# Altium schematic sheet 13_Temp3.SchDoc: Misc
size A3; Organization: Lime Microsystems; Address1: Surrey Tech Centre; Address2: Guildford GU2 7YG; Address3: Surrey; Address4: United Kingdom; Revision: v1.1; SheetNumber: 10; SheetTotal: 10
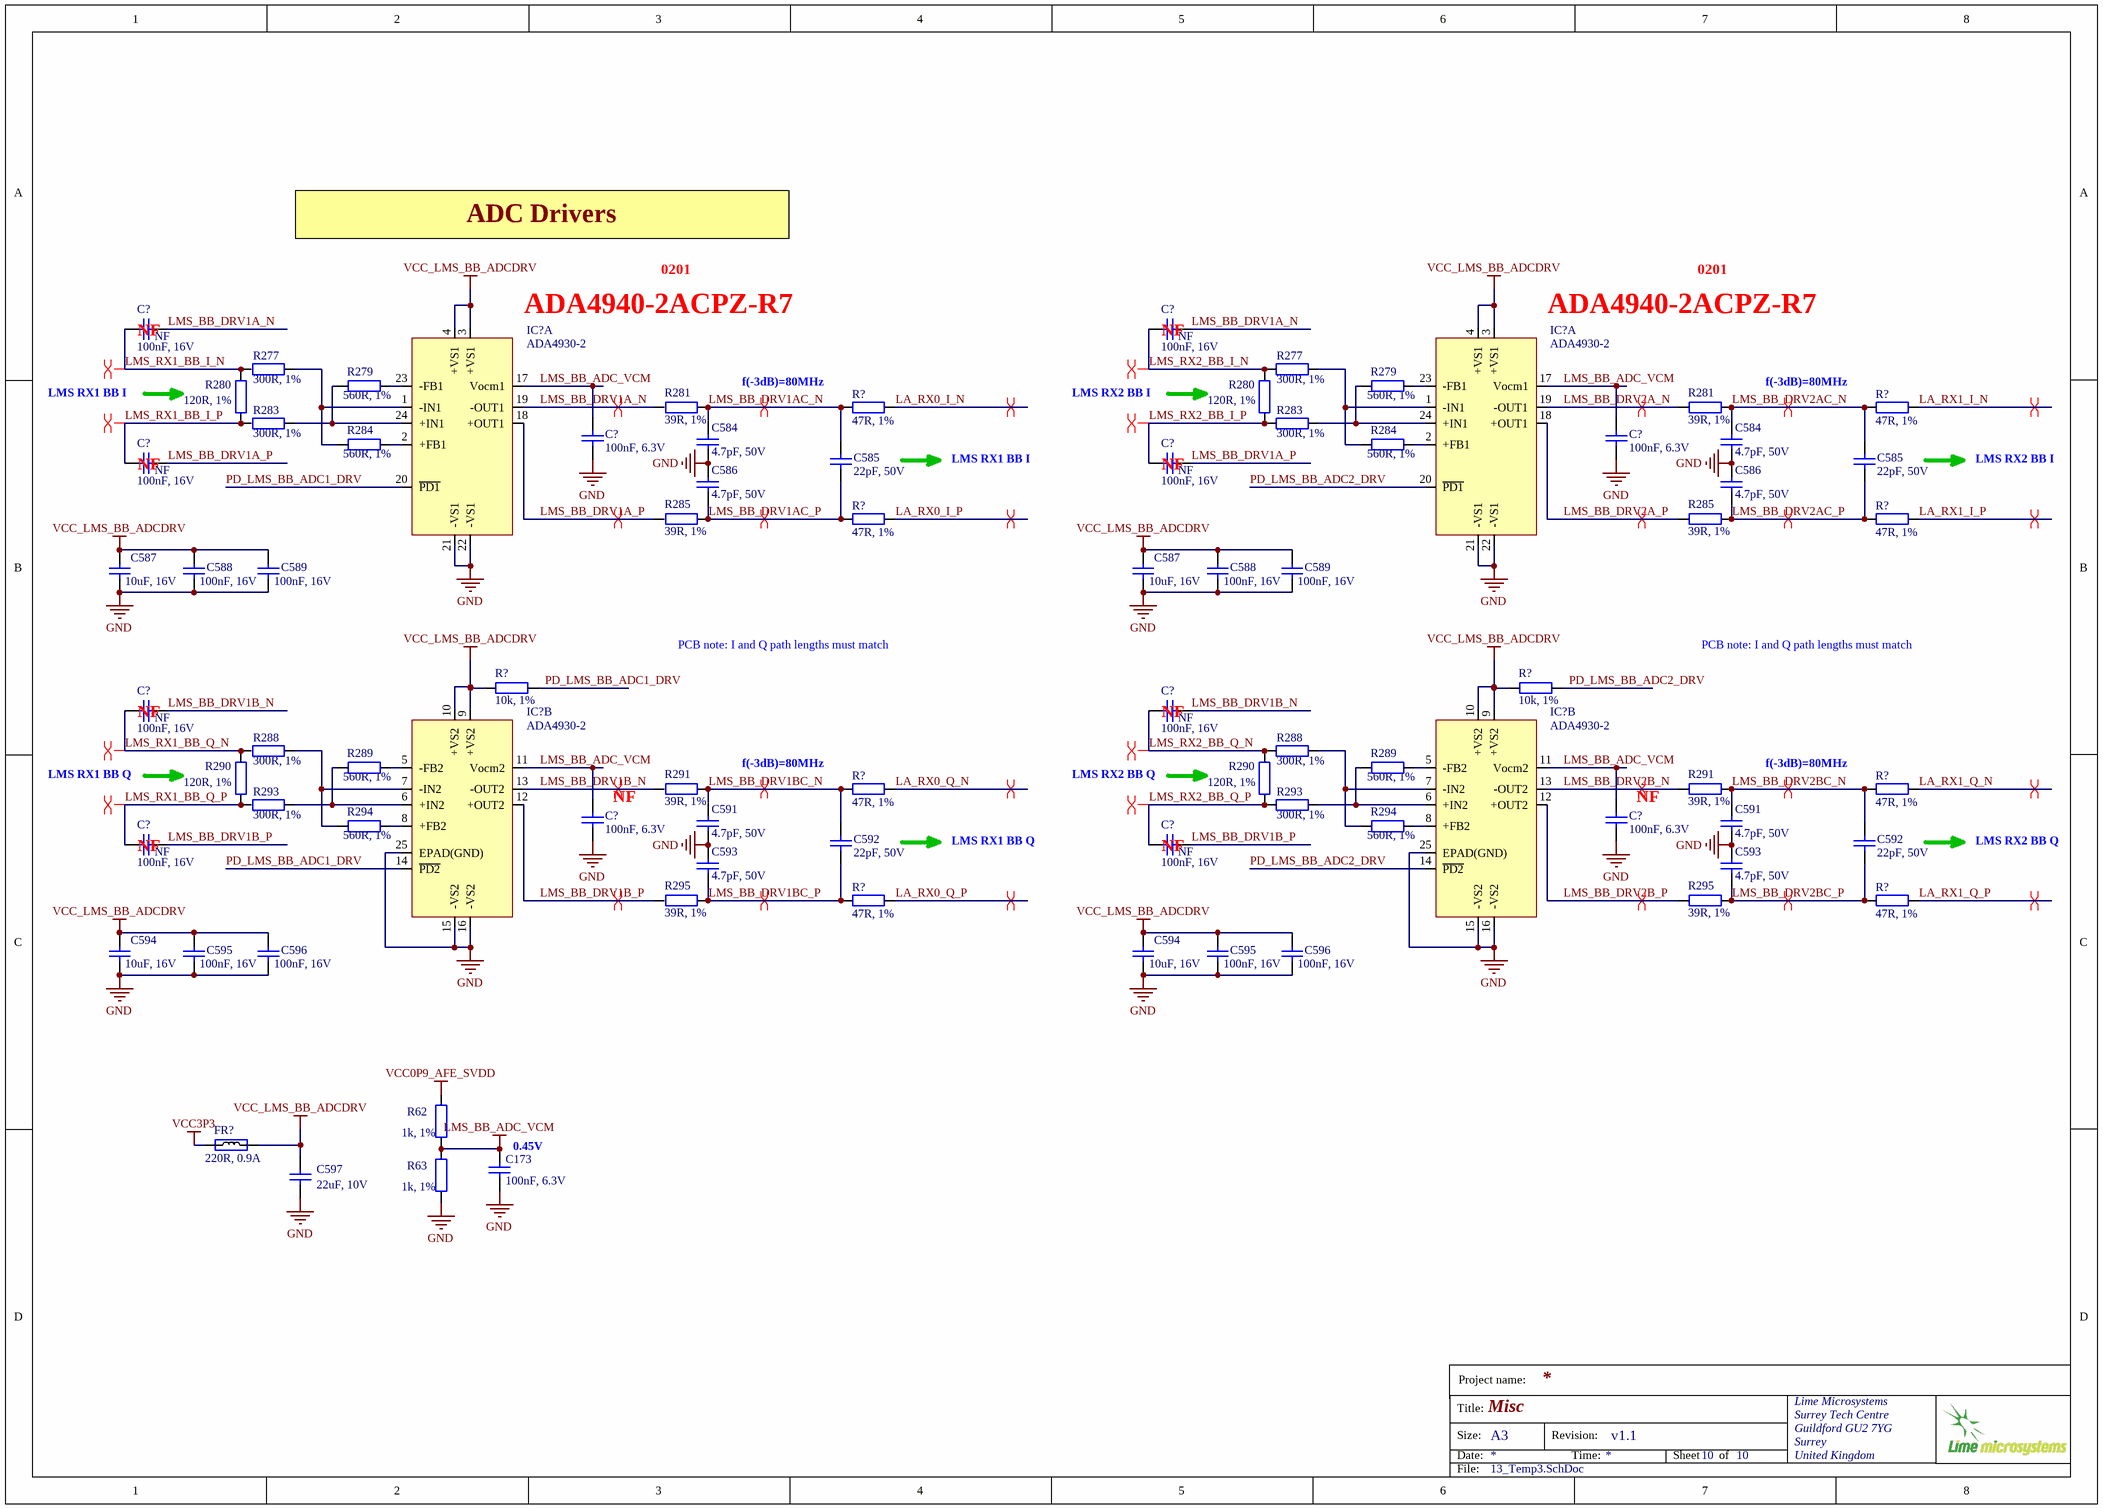
[diagram p0: 13_Temp3.SchDoc]

## Parts
(Parts that share a designator on the sheet are numbered #1, #2 ... from top to bottom, then left to right.)
C173  100nF, 6.3V  [CAP0201]
C584#1  4.7pF, 50V  [CAP0402]
C584#2  4.7pF, 50V  [CAP0402]
C585#1  22pF, 50V  [CAP0402]
C585#2  22pF, 50V  [CAP0402]
C586#1  4.7pF, 50V  [CAP0402]
C586#2  4.7pF, 50V  [CAP0402]
C587#1  10uF, 16V  [CAP0603]
C587#2  10uF, 16V  [CAP0603]
C588#1  100nF, 16V  [CAP0402]
C588#2  100nF, 16V  [CAP0402]
C589#1  100nF, 16V  [CAP0402]
C589#2  100nF, 16V  [CAP0402]
C591#1  4.7pF, 50V  [CAP0402]
C591#2  4.7pF, 50V  [CAP0402]
C592#1  22pF, 50V  [CAP0402]
C592#2  22pF, 50V  [CAP0402]
C593#1  4.7pF, 50V  [CAP0402]
C593#2  4.7pF, 50V  [CAP0402]
C594#1  10uF, 16V  [CAP0603]
C594#2  10uF, 16V  [CAP0603]
C595#1  100nF, 16V  [CAP0402]
C595#2  100nF, 16V  [CAP0402]
C596#1  100nF, 16V  [CAP0402]
C596#2  100nF, 16V  [CAP0402]
C597  22uF, 10V  [CAP0603]
C?#1  100nF, 16V  Assembly Info: NF  [CAP0402]
C?#2  100nF, 16V  Assembly Info: NF  [CAP0402]
C?#3  100nF, 6.3V  [CAP0201]
C?#4  100nF, 6.3V  [CAP0201]
C?#5  100nF, 16V  Assembly Info: NF  [CAP0402]
C?#6  100nF, 16V  Assembly Info: NF  [CAP0402]
C?#7  100nF, 16V  Assembly Info: NF  [CAP0402]
C?#8  100nF, 16V  Assembly Info: NF  [CAP0402]
C?#9  100nF, 6.3V  [CAP0201]
C?#10  100nF, 6.3V  [CAP0201]
C?#11  100nF, 16V  Assembly Info: NF  [CAP0402]
C?#12  100nF, 16V  Assembly Info: NF  [CAP0402]
FR?  220R, 0.9A  [RES0402]
IC?#1  ADA4930-2  [ADA4930-2_LFCSP-24]  (part A of 2)
IC?#2  ADA4930-2  [ADA4930-2_LFCSP-24]  (part A of 2)
IC?#3  ADA4930-2  [ADA4930-2_LFCSP-24]  (part B of 2)
IC?#4  ADA4930-2  [ADA4930-2_LFCSP-24]  (part B of 2)
R62  1k, 1%  [RES0201]
R63  1k, 1%  [RES0201]
R277#1  300R, 1%  [RES0402]
R277#2  300R, 1%  [RES0402]
R279#1  560R, 1%  [RES0402]
R279#2  560R, 1%  [RES0402]
R280#1  120R, 1%  [RES0402]
R280#2  120R, 1%  [RES0402]
R281#1  39R, 1%  [RES0402]
R281#2  39R, 1%  [RES0402]
R283#1  300R, 1%  [RES0402]
R283#2  300R, 1%  [RES0402]
R284#1  560R, 1%  [RES0402]
R284#2  560R, 1%  [RES0402]
R285#1  39R, 1%  [RES0402]
R285#2  39R, 1%  [RES0402]
R288#1  300R, 1%  [RES0402]
R288#2  300R, 1%  [RES0402]
R289#1  560R, 1%  [RES0402]
R289#2  560R, 1%  [RES0402]
R290#1  120R, 1%  [RES0402]
R290#2  120R, 1%  [RES0402]
R291#1  39R, 1%  [RES0402]
R291#2  39R, 1%  [RES0402]
R293#1  300R, 1%  [RES0402]
R293#2  300R, 1%  [RES0402]
R294#1  560R, 1%  [RES0402]
R294#2  560R, 1%  [RES0402]
R295#1  39R, 1%  [RES0402]
R295#2  39R, 1%  [RES0402]
R?#1  47R, 1%  [RES0201]
R?#2  47R, 1%  [RES0201]
R?#3  47R, 1%  [RES0201]
R?#4  47R, 1%  [RES0201]
R?#5  10k, 1%  [RES0201]
R?#6  10k, 1%  [RES0201]
R?#7  47R, 1%  [RES0201]
R?#8  47R, 1%  [RES0201]
R?#9  47R, 1%  [RES0201]
R?#10  47R, 1%  [RES0201]

## Nets
GND: C173.2 C584#1.2 C584#2.2 C586#1.1 C586#2.1 C587#1.1 C587#2.1 C588#1.2 C588#2.2 C589#1.2 C589#2.2 C591#1.2 C591#2.2 C593#1.1 C593#2.1 C594#1.1 C594#2.1 C595#1.2 C595#2.2 C596#1.2 C596#2.2 C597.1 C?#3.1 C?#4.1 C?#9.1 C?#10.1 IC?#1.21(-VS1) IC?#1.22(-VS1) IC?#2.21(-VS1) IC?#2.22(-VS1) IC?#3.15(-VS2) IC?#3.16(-VS2) IC?#3.25(EPAD(GND)) IC?#4.15(-VS2) IC?#4.16(-VS2) IC?#4.25(EPAD(GND)) R63.2
LMS_BB_ADC_VCM: C173.1 C?#3.2 C?#4.2 C?#9.2 C?#10.2 IC?#1.17(Vocm1) IC?#2.17(Vocm1) IC?#3.11(Vocm2) IC?#4.11(Vocm2) R62.2 R63.1
VCC0P9_AFE_SVDD: R62.1
VCC3P3: FR?.1
VCC_LMS_BB_ADCDRV: C587#1.2 C587#2.2 C588#1.1 C588#2.1 C589#1.1 C589#2.1 C594#1.2 C594#2.2 C595#1.1 C595#2.1 C596#1.1 C596#2.1 C597.2 FR?.2 IC?#1.3(+VS1) IC?#1.4(+VS1) IC?#2.3(+VS1) IC?#2.4(+VS1) IC?#3.9(+VS2) IC?#3.10(+VS2) IC?#4.9(+VS2) IC?#4.10(+VS2) R?#5.1 R?#6.1
LA_RX0_I_N: R?#1.1
LA_RX0_I_P: R?#3.1
LA_RX0_Q_N: R?#7.1
LA_RX0_Q_P: R?#9.1
LA_RX1_I_N: R?#2.1
LA_RX1_I_P: R?#4.1
LA_RX1_Q_N: R?#8.1
LA_RX1_Q_P: R?#10.1
LMS_BB_DRV1A_N: C?#1.2 C?#2.2 IC?#1.19(-OUT1) R281#1.2
LMS_BB_DRV1A_P: C?#5.2 C?#6.2 IC?#1.18(+OUT1) R285#1.2
LMS_BB_DRV1AC_N: C584#1.1 C585#1.1 R281#1.1 R?#1.2
LMS_BB_DRV1AC_P: C585#1.2 C586#1.2 R285#1.1 R?#3.2
LMS_BB_DRV1B_N: C?#7.2 C?#8.2 IC?#3.13(-OUT2) R291#1.2
LMS_BB_DRV1B_P: C?#11.2 C?#12.2 IC?#3.12(+OUT2) R295#1.2
LMS_BB_DRV1BC_N: C591#1.1 C592#1.1 R291#1.1 R?#7.2
LMS_BB_DRV1BC_P: C592#1.2 C593#1.2 R295#1.1 R?#9.2
LMS_BB_DRV2A_N: IC?#2.19(-OUT1) R281#2.2
LMS_BB_DRV2A_P: IC?#2.18(+OUT1) R285#2.2
LMS_BB_DRV2AC_N: C584#2.1 C585#2.1 R281#2.1 R?#2.2
LMS_BB_DRV2AC_P: C585#2.2 C586#2.2 R285#2.1 R?#4.2
LMS_BB_DRV2B_N: IC?#4.13(-OUT2) R291#2.2
LMS_BB_DRV2B_P: IC?#4.12(+OUT2) R295#2.2
LMS_BB_DRV2BC_N: C591#2.1 C592#2.1 R291#2.1 R?#8.2
LMS_BB_DRV2BC_P: C592#2.2 C593#2.2 R295#2.1 R?#10.2
LMS_RX1_BB_I_N: C?#1.1 R277#1.2 R280#1.2
LMS_RX1_BB_I_P: C?#5.1 R280#1.1 R283#1.2
LMS_RX1_BB_Q_N: C?#7.1 R288#1.2 R290#1.2
LMS_RX1_BB_Q_P: C?#11.1 R290#1.1 R293#1.2
LMS_RX2_BB_I_N: C?#2.1 R277#2.2 R280#2.2
LMS_RX2_BB_I_P: C?#6.1 R280#2.1 R283#2.2
LMS_RX2_BB_Q_N: C?#8.1 R288#2.2 R290#2.2
LMS_RX2_BB_Q_P: C?#12.1 R290#2.1 R293#2.2
PD_LMS_BB_ADC1_DRV: IC?#1.20(~{PD1}) IC?#3.14(~{PD2}) R?#5.2
PD_LMS_BB_ADC2_DRV: IC?#2.20(~{PD1}) IC?#4.14(~{PD2}) R?#6.2
NetIC?#1_1: IC?#1.1(-IN1) R277#1.1 R284#1.2
NetIC?#1_2: IC?#1.2(+FB1) R284#1.1
NetIC?#1_23: IC?#1.23(-FB1) R279#1.1
NetIC?#1_24: IC?#1.24(+IN1) R279#1.2 R283#1.1
NetIC?#2_1: IC?#2.1(-IN1) R277#2.1 R284#2.2
NetIC?#2_2: IC?#2.2(+FB1) R284#2.1
NetIC?#2_23: IC?#2.23(-FB1) R279#2.1
NetIC?#2_24: IC?#2.24(+IN1) R279#2.2 R283#2.1
NetIC?#3_5: IC?#3.5(-FB2) R289#1.1
NetIC?#3_6: IC?#3.6(+IN2) R289#1.2 R293#1.1
NetIC?#3_7: IC?#3.7(-IN2) R288#1.1 R294#1.2
NetIC?#3_8: IC?#3.8(+FB2) R294#1.1
NetIC?#4_5: IC?#4.5(-FB2) R289#2.1
NetIC?#4_6: IC?#4.6(+IN2) R289#2.2 R293#2.1
NetIC?#4_7: IC?#4.7(-IN2) R288#2.1 R294#2.2
NetIC?#4_8: IC?#4.8(+FB2) R294#2.1

## Layout directives
differential pair: LA_RX0_I_N, LA_RX0_I_P, LA_RX0_Q_N, LA_RX0_Q_P, LA_RX1_I_N, LA_RX1_I_P, LA_RX1_Q_N, LA_RX1_Q_P, LMS_BB_DRV1A_N, LMS_BB_DRV1A_P, LMS_BB_DRV1AC_N, LMS_BB_DRV1AC_P, LMS_BB_DRV1B_N, LMS_BB_DRV1B_P, LMS_BB_DRV1BC_N, LMS_BB_DRV1BC_P, LMS_BB_DRV2A_N, LMS_BB_DRV2A_P, LMS_BB_DRV2AC_N, LMS_BB_DRV2AC_P, LMS_BB_DRV2B_N, LMS_BB_DRV2B_P, LMS_BB_DRV2BC_N, LMS_BB_DRV2BC_P, LMS_RX1_BB_I_N, LMS_RX1_BB_I_P, LMS_RX1_BB_Q_N, LMS_RX1_BB_Q_P, LMS_RX2_BB_I_N, LMS_RX2_BB_I_P, LMS_RX2_BB_Q_N, LMS_RX2_BB_Q_P

## Notes on the sheet
- ADC Drivers
- (near IC?#1) ADA4940-2ACPZ-R7
- 0201
- (near IC?#2) ADA4940-2ACPZ-R7
- (near C?#1) NF
- f(-3dB)=80MHz
- (near C?#2) NF
- LMS RX1 BB I
- LMS RX2 BB I
- (near C?#5) NF
- (near C?#6) NF
- PCB note: I and Q path lengths must match
- (near C?#7) NF
- (near C?#8) NF
- LMS RX1 BB Q
- LMS RX2 BB Q
- (near C?#11) NF
- NF
- (near C?#12) NF
- (near C173) 0.45V
- Project name:
- Title:
- Size:
- Date:
- A3
- Revision:
- Time:
- Sheet
- of
- File:

## Library data of the parts
C173 C?#3 C?#4 C?#9 C?#10 = Cap_0402: Part Description: 100 pF ±5% 50V Ceramic Capacitor C0G, NP0 0201 (0603 Metric); Manufacturer: Samsung; Manufacturer Part Number 1: CL03A104MP3NNNC; Tolerance: 20%; Voltage Rating (DC): 10V; Value: 100nF, 6.3V; Capacitance: 100nF; Case/Package: 0201; Case Code (Imperial): 0201; Case Code (Metric): 0603; ComponentLink5Description: https://datasheet.ciiva.com/25788/cl03a104mp3nnnc-25788272.pdf?src-supplier=Digi-Key; ComponentLink5URL: https://datasheet.ciiva.com/25788/cl03a104mp3nnnc-25788272.pdf?src-supplier=Digi-Key; Length: 0.024inch; Max Operating Temperature: 85°C; Min Operating Temperature: -55°C; Mount: Surface Mount; Package Quantity: 1; Packaging: Tape and Reel; Pricing 1: 1=0,10000, 10=0,03000, 50=0,01640, 100=0,01330, 500=0,00950, 1000=0,00747, 2500=0,00679, 5000=0,00625 (USD); RoHS: Yes; RoHS Compliant: Yes; Series: CL; Stock 1: 3817176; Supplier 1: Digi-Key; Supplier Part Number 1: 1276-1321-1-ND; Thickness: 0.013inch; Voltage Rating: 10V; Width: 0.012inch
C584#1 C584#2 C586#1 C586#2 C591#1 C591#2 C593#1 C593#2 = Cap_0402: Manufacturer: MURATA; Manufacturer Part Number 1: GRM1555C1H4R7CA01D; Part Description: 4.7pF ±0.25pF 50V Ceramic Capacitor C0G, NP0 0402 (1005 Metric); Capacitance Tolerance: ± 0.25; Voltage Rating: 50; Dielectric Characteristic: C0G / NP0; Ceramic Capacitor Case: 0402 [1005 Metric]; Capacitance: 4.7; SVHC: No SVHC (15-Jun-2015; Product Range: GRM Series; Value: 4.7pF, 50V; Supplier 1: Farnell; Supplier Part Number 1: 2434644; Operating Temperature Max: 125; Operating Temperature Min: -55; MSL: MSL 1 - Unlimited; RoHS: YES; Packaging: Cut Tape
C585#1 C585#2 C592#1 C592#2 = Cap_0402: Manufacturer: Yageo; Manufacturer Part Number 1: CC0402JRNPO9BN220; Part Description: 22pF ±5% 50V C0G, NP0 Ceramic Capacitor -55°C ~ 125°C Surface Mount, MLCC 0402 (1005 Metric) 0.039" L x 0.020" W (1.00mm x 0.50mm); Tolerance: ±5%; Temperature Coefficient: C0G, NP0; Value: 22pF, 50V; Supplier 1: Digi-Key; Supplier Part Number 1: 311-1018-2-ND; Category: Capacitors; Voltage - Rated: 50V; Packaging: Tape & Reel (TR); RoHS: RoHS Compliant; Capacitance: 22pF; Operating Temperature: -55°C ~ 125°C; Mounting Type: Surface Mount, MLCC; Height - Seated (Max): -; Size / Dimension: 0.039" L x 0.020" W (1.00mm x 0.50mm); Ratings: -; Applications: General Purpose; Thickness (Max): 0.022" (0.55mm); Lead Spacing: -; Lead Style: -; Features: -; Package / Case: 0402 (1005 Metric)
C587#1 C587#2 C594#1 C594#2 = Cap_0603: Manufacturer: Yageo; Manufacturer Part Number 1: GRM188R61C106MA73D; Part Description: 10µF ±20% 16V Ceramic Capacitor X5R 0603 (1608 Metric); Temperature Coefficient: X5R; Capacitance: 10µF; Tolerance: ±20%; Value: 10uF, 16V; Supplier 1: Digi-Key; Supplier Part Number 1: 490-7201-2-ND; Category: Capacitors; Ratings: -; Features: -; Lead Style: -; Package / Case: 0603 (1608 Metric); Lead Spacing: -; Applications: General Purpose; Voltage - Rated: 16V; Operating Temperature: -55°C ~ 85°C; Thickness (Max): 0.039" (1.00mm); Mounting Type: Surface Mount, MLCC; RoHS: RoHS Compliant; Size / Dimension: 0.063" L x 0.031" W (1.60mm x 0.80mm); Packaging: Tape & Reel (TR); Height - Seated (Max): -
C588#1 C588#2 C589#1 C589#2 C595#1 C595#2 C596#1 C596#2 C?#1 C?#2 C?#5-C?#8 C?#11 C?#12 = Cap_0603: Manufacturer Part Number 1: GRM155R71C104KA88D; Part Description: 0.10µF ±10% 16V X7R Ceramic Capacitor -55°C ~ 125°C Surface Mount, MLCC 0402 (1005 Metric) 0.039" L x 0.020" W (1.00mm x 0.50mm); Brand: Murata Electronics; Tolerance: 10 %; Type: General Purpose MLCC; Capacitance: 0.1 uF; Temperature Coefficient / Code: +/- 15 %; Case Height: 0.5 mm; Case Length: 1 mm; Dielectric: X7R; Supplier 1: Mouser; Supplier Part Number 1: 81-GRM155R71C104KA88; Case Code - in: 0402; Manufacturer: Murata Electronics; Category: Multilayer Ceramic Capacitors MLCC - SMD/SMT; Voltage Rating DC: 16 V; Value: 100nF, 16V; Case Code - mm: 1005; Case Width: 0.5 mm; Maximum Operating Temperature: + 125 C; Minimum Operating Temperature: - 55 C; Minimum Order Quantity: 1; Operating Temperature Range: - 55 C to + 125 C; Package / Case: 0402 (1005 metric); Packaging: Reel; Product: General Type MLCCs; Product Category: Low & Medium Capacitance SMD Ceramic Chip Capacitors; Reeling: True; RoHS - Mouser: Y; RoHS: RoHS Compliant; Series: GRM; Standard Pack Qty: 10000; Termination Style: SMD/SMT
C597 = Cap_0603: Manufacturer Part Number 1: C1608X5R1A226M080AC; Part Description: 22µF ±20% 10V Ceramic Capacitor X5R 0603 (1608 Metric); Manufacturer: TDK Corporation; Brand: TDK; Temperature Coefficient / Code: +/- 15 %; Tolerance: 20 %; Type: Multilayer Ceramic Chip Capacitor; Supplier 1: Mouser; Supplier Part Number 1: 810-C1608X5R1A226M; Package / Case: 0603 (1608 metric); Category: Multilayer Ceramic Capacitors MLCC - SMD/SMT; Capacitance: 22uF; Operating Temperature Range: - 55 C to + 85 C; Case Code - in: 0603; Voltage Rating DC: 10 V; Case Code - mm: 1608; Value: 22uF, 10V
FR? = Ferrite: Manufacturer: TDK Corporation; Manufacturer Part Number 1: MPZ1005S221ET000; Part Description: FERRITE BEAD 220 OHM 0402 1LN; Impedance @ Frequency: 220 Ohm @ 100MHz; Current Rating: 900mA; DC Resistance (DCR): 220 mOhm Max; Supplier 1: Digi-Key; Package / Case: 0402 (1005 Metric); Category: Filters; Supplier Part Number 1: 445-9329-2-ND; Value: 220R, 0.9A
IC?#1 IC?#2 = ADA4930-2: Manufacturer: Analog Devices Inc.; Manufacturer Part Number 1: ADA4930-2YCPZ-R7; Part Description: Differential Amplifier 2 Circuit Differential 24-LFCSP-WQ (4x4); Amplifier Type: Differential; Voltage - Supply, Single/Dual (±): 3.3V, 5V; Number of Circuits: 2; Current - Supply: 34mA; Slew Rate: 3400 V/µs; Voltage - Input Offset: 150µV; Current - Input Bias: 23µA; -3db Bandwidth: 1.35GHz; Current - Output / Channel: 30mA; Supplier 1: Digi-Key; Mounting Type: Surface Mount; Gain Bandwidth Product: -; Supplier Device Package: 24-LFCSP-VQ (4x4); Category: Integrated Circuits (ICs); Operating Temperature: -40°C ~ 105°C; Packaging: Cut Tape (CT); RoHS: RoHS Compliant; Package / Case: 24-VFQFN Exposed Pad, CSP; Output Type: Differential; Supplier Part Number 1: ADA4930-2YCPZ-R7CT-ND
IC?#3 IC?#4 = ADA4930-2: Manufacturer: Analog Devices Inc.; Manufacturer Part Number 1: ADA4930-2YCPZ-R7; Amplifier Type: Differential; Voltage - Supply, Single/Dual (±): 3.3V, 5V; Number of Circuits: 2; Current - Supply: 34mA; Slew Rate: 3400 V/µs; Voltage - Input Offset: 150µV; Current - Input Bias: 23µA; -3db Bandwidth: 1.35GHz; Current - Output / Channel: 30mA; Supplier 1: Digi-Key; Mounting Type: Surface Mount; Gain Bandwidth Product: -; Supplier Device Package: 24-LFCSP-VQ (4x4); Category: Integrated Circuits (ICs); Operating Temperature: -40°C ~ 105°C; Packaging: Cut Tape (CT); RoHS: RoHS Compliant; Package / Case: 24-VFQFN Exposed Pad, CSP; Output Type: Differential; Supplier Part Number 1: ADA4930-2YCPZ-R7CT-ND
R62 R63 = Res_0402: Manufacturer: Yageo; Manufacturer Part Number 1: RC0201FR-071KL; Part Description: 1 kOhms ±1% 0.05W, 1/20W Chip Resistor 0201 (0603 Metric) Moisture Resistant Thick Film; Resistance: 1kR; Power Rating: 50mW; Voltage Rating: 25V; Temperature Coefficient: 200ppm/°C; Value: 1k, 1%; Supplier 1: Digi-Key; Supplier Part Number 1: 311-1KMDKR-ND; Stock 1: 9099863; Pricing 1: 1=0,10000, 10=0,03700, 100=0,01530, 1000=0,00685, 2500=0,00595, 5000=0,00491 (USD); RoHS: Yes; Case/Package: 0201; Case Code (Metric): 0603; Case Code (Imperial): 0201; Contact Plating: Tin,Matte; Min Operating Temperature: -55°C; Max Operating Temperature: 125°C; Package Quantity: 10000; Packaging: Tape and Reel; Tolerance: 1%; Resistor Type: Thick Film; Number of Terminations: 2; Termination: SMD/SMT; Max Power Dissipation: 50mW; Working Voltage: 25V; Features: Moisture Resistant; Series: RC; Resistance Tolerance: 1%; Technology: THICK FILM; Construction: Rectangular; Length: 0.024inch; Width: 0.012inch; Height: 0.01inch; Depth: 0.3mm; Radiation Hardening: No; Military Standard: Not; Lead Free: Lead Free; RoHS Compliant: Yes; ComponentLink1URL: https://datasheet.ciiva.com/7672/1563626-7672204.pdf?src-supplier=Element14; ComponentLink1Description: https://datasheet.ciiva.com/7672/1563626-7672204.pdf?src-supplier=Element14; ComponentLink2URL: https://datasheet.ciiva.com/22698/1563626-22698505.pdf?src-supplier=Element14; ComponentLink2Description: https://datasheet.ciiva.com/22698/1563626-22698505.pdf?src-supplier=Element14; ComponentLink3URL: https://datasheet.ciiva.com/29721/pyu-r-int-thick-7-29721196.pdf?src-supplier=Digi-Key; ComponentLink3Description: https://datasheet.ciiva.com/29721/pyu-r-int-thick-7-29721196.pdf?src-supplier=Digi-Key; ComponentLink4URL: https://datasheet.ciiva.com/29721/pyu-r-int-thick-7-29721195.pdf?src-supplier=Digi-Key; ComponentLink4Description: https://datasheet.ciiva.com/29721/pyu-r-int-thick-7-29721195.pdf?src-supplier=Digi-Key; ComponentLink5URL: https://datasheet.ciiva.com/8896/pyu-rc0201-51-rohs-l-8-8896174.pdf?src-supplier=Avnet; ComponentLink5Description: https://datasheet.ciiva.com/8896/pyu-rc0201-51-rohs-l-8-8896174.pdf?src-supplier=Avnet
R277#1 R277#2 R283#1 R283#2 R288#1 R288#2 R293#1 R293#2 = Res_0402: Manufacturer: Vishay Dale; Part Description: RES SMD 300 OHM 1% 1/16W 0402; Manufacturer Part Number 1: CRCW0402300RFKED; Resistance (Ohms): 300; Temperature Coefficient: ±100ppm/°C; Power (Watts): 0.063W, 1/16W; Value: 300R, 1%; Supplier 1: Digi-Key; Supplier Device Package: 0402 (1005 Metric); Composition: Thick Film; Features: Automotive AEC-Q200; Packaging: Cut Tape (CT); Size / Dimension: 0.039" L x 0.020" W (1.00mm x 0.50mm); Category: Resistors; Package / Case: 0402 (1005 Metric); Supplier Part Number 1: 541-300LCT-ND; Number of Terminations: 2; Tolerance: ±1%; Height: 0.016" (0.40mm); Operating Temperature: -55°C ~ 155°C; RoHS: RoHS Compliant
R279#1 R279#2 R284#1 R284#2 R289#1 R289#2 R294#1 R294#2 = Res_0402: Manufacturer: Vishay Dale; Part Description: RES SMD 560 OHM 1% 1/16W 0402; Manufacturer Part Number 1: CRCW0402560RFKED; Resistance (Ohms): 560; Temperature Coefficient: ±100ppm/°C; Power (Watts): 0.063W, 1/16W; Value: 560R, 1%; Supplier Device Package: 0402 (1005 Metric); Composition: Thick Film; Packaging: Cut Tape (CT); Number of Terminations: 2; Operating Temperature: -55°C ~ 155°C; Supplier Part Number 1: 541-560LCT-ND; Supplier 1: Digi-Key; Category: Resistors; Height: 0.016" (0.40mm); Features: Automotive AEC-Q200; Size / Dimension: 0.039" L x 0.020" W (1.00mm x 0.50mm); Tolerance: ±1%; Package / Case: 0402 (1005 Metric); RoHS: RoHS Compliant
R280#1 R280#2 R290#1 R290#2 = Res_0402: Manufacturer: Yageo; Manufacturer Part Number 1: RC0402FR-07120RL; Part Description: 120 Ohms ±1% 0.063W, 1/16W Chip Resistor 0402 (1005 Metric) Moisture Resistant Thick Film; Power Rating: 62.5mW; Voltage Rating: 50V; Temperature Coefficient: 100ppm/°C; Max Power Dissipation: 63mW; Value: 120R, 1%; Supplier 1: Digi-Key; Supplier Part Number 1: 311-120LRCT-ND; Stock 1: 1593308; Pricing 1: 1=0.1, 10=0.016, 100=0.0067, 1000=0.00301, 2500=0.00261, 5000=0.00215 (USD); Case/Package: 0402; Case Code (Imperial): 0402; Case Code (Metric): 1005; Min Operating Temperature: -55°C; Max Operating Temperature: 155°C; Package Quantity: 1; Resistance: 120R; Tolerance: 1%; Packaging: Tape and Reel; Termination: SMD/SMT; Composition: Thick Film; Number of Terminations: 2; Military Standard: Not; Features: Moisture Resistant; Length: 1mm; Height: 0.016inch; Width: 0.02inch; Depth: 0.5mm; REACH SVHC: No SVHC; Lead Free: Lead Free; ComponentLink1URL: http://www.farnell.com/datasheets/1018594.pdf?src-supplier=Element14; ComponentLink1Description: http://www.farnell.com/datasheets/1018594.pdf?src-supplier=Element14; ComponentLink2URL: http://www.mouser.com/ds/2/447/PYu-RC0402_51_RoHS_L_6_r-8721.pdf?src-supplier=Mouser; ComponentLink2Description: http://www.mouser.com/ds/2/447/PYu-RC0402_51_RoHS_L_6_r-8721.pdf?src-supplier=Mouser; ComponentLink3URL: http://documents.rs-components.com/techlib://itc_doclist_GB.htm?stockno=6185898&src-supplier=RSComponents; ComponentLink3Description: http://documents.rs-components.com/techlib://itc_doclist_GB.htm?stockno=6185898&src-supplier=RSComponents; ComponentLink4URL: http://www.yageo.com/documents/recent/PYu-RC_Group_51_RoHS_L_10.pdf?src-supplier=Digi-Key; ComponentLink4Description: http://www.yageo.com/documents/recent/PYu-RC_Group_51_RoHS_L_10.pdf?src-supplier=Digi-Key; ComponentLink5URL: http://www.yageo.com/documents/recent/PYu-RC0402_51_RoHS_L_6_r.pdf?src-supplier=Future+Electronics; ComponentLink5Description: http://www.yageo.com/documents/recent/PYu-RC0402_51_RoHS_L_6_r.pdf?src-supplier=Future+Electronics
R281#1 R281#2 R285#1 R285#2 R291#1 R291#2 R295#1 R295#2 = Res_0402: Manufacturer: Yageo; Manufacturer Part Number 1: RC0402FR-0739RL; Part Description: 39 Ohms ±1% 0.063W, 1/16W Chip Resistor 0402 (1005 Metric) Moisture Resistant Thick Film; Power Rating: 63mW; Voltage Rating: 50V; Temperature Coefficient: 100ppm/°C; Value: 39R, 1%; ComponentLink1URL: http://www.yageo.com.tw/exep/pages/download/literatures/PYu-R_INT-thick_7.pdf?src-supplier=Digi-Key; ComponentLink1Description: http://www.yageo.com.tw/exep/pages/download/literatures/PYu-R_INT-thick_7.pdf?src-supplier=Digi-Key; ComponentLink2URL: http://www.yageo.com/NewPortal/yageodocoutput?fileName=/pdf/R-Chip/PYu-RC_51_RoHS_P_0.pdf&src-supplier=Digi-Key; ComponentLink2Description: http://www.yageo.com/NewPortal/yageodocoutput?fileName=/pdf/R-Chip/PYu-RC_51_RoHS_P_0.pdf&src-supplier=Digi-Key; Supplier 1: Digi-Key; Supplier Part Number 1: 311-39.0LRCT-ND; Stock 1: 1060646; Pricing 1: 1=0,10000, 10=0,01600, 100=0,00660, 1000=0,00299, 2500=0,00259, 5000=0,00214 (USD); RoHS: Yes; Case/Package: 0402; Case Code (Imperial): 0402; Case Code (Metric): 1005; Weight: 2.3E-05oz; Contact Plating: Tin,Matte; Min Operating Temperature: -55°C; Max Operating Temperature: 155°C; Tolerance: 1%; Package Quantity: 1; Packaging: Tape and Reel; Features: Moisture Resistant; Resistance: 39R; Termination: SMD/SMT; Resistor Type: Thick Film; Number of Terminations: 2; Max Power Dissipation: 63mW; Working Voltage: 50V; Series: RC; Resistance Tolerance: 1%; Construction: Rectangular; Technology: THICK FILM; Length: 1mm; Width: 0.5mm; Height: 0.016inch; Depth: 0.5mm; Radiation Hardening: No; Lead Free: Lead Free; REACH SVHC: Unknown; Military Standard: Not; RoHS Compliant: Yes; ComponentLink3URL: https://datasheet.ciiva.com/11819/0900766b80c66297-11819479.pdf?src-supplier=RSComponents; ComponentLink3Description: https://datasheet.ciiva.com/11819/0900766b80c66297-11819479.pdf?src-supplier=RSComponents; ComponentLink4URL: https://datasheet.ciiva.com/2519/pyu-r-int-thick-7-2519001.pdf?src-supplier=Digi-Key; ComponentLink4Description: https://datasheet.ciiva.com/2519/pyu-r-int-thick-7-2519001.pdf?src-supplier=Digi-Key; ComponentLink5URL: https://datasheet.ciiva.com/2519/pyu-r-int-thick-7-2519002.pdf?src-supplier=Digi-Key; ComponentLink5Description: https://datasheet.ciiva.com/2519/pyu-r-int-thick-7-2519002.pdf?src-supplier=Digi-Key; ComponentLink6URL: https://datasheet.ciiva.com/2519/pyu-r-int-thick-7-2519000.pdf?src-supplier=Digi-Key; ComponentLink6Description: https://datasheet.ciiva.com/2519/pyu-r-int-thick-7-2519000.pdf?src-supplier=Digi-Key; ComponentLink7URL: https://datasheet.ciiva.com/7849/1018594-7849983.pdf?src-supplier=Element14; ComponentLink7Description: https://datasheet.ciiva.com/7849/1018594-7849983.pdf?src-supplier=Element14; ComponentLink8URL: https://datasheet.ciiva.com/7849/1018594-7849982.pdf?src-supplier=Element14; ComponentLink8Description: https://datasheet.ciiva.com/7849/1018594-7849982.pdf?src-supplier=Element14; ComponentLink9URL: https://datasheet.ciiva.com/8889/pyu-rc0402-51-rohs-l-6-8889306.pdf?src-supplier=Avnet; ComponentLink9Description: https://datasheet.ciiva.com/8889/pyu-rc0402-51-rohs-l-6-8889306.pdf?src-supplier=Avnet; ComponentLink10URL: https://datasheet.ciiva.com/16741/pyu-rc0402-51-rohs-l-6-r-16741016.pdf?src-supplier=Future+Electronics; ComponentLink10Description: https://datasheet.ciiva.com/16741/pyu-rc0402-51-rohs-l-6-r-16741016.pdf?src-supplier=Future+Electronics; ComponentLink11URL: https://datasheet.ciiva.com/15189/getdatasheetpartid-325130-15189445.pdf?src-supplier=Verical; ComponentLink11Description: https://datasheet.ciiva.com/15189/getdatasheetpartid-325130-15189445.pdf?src-supplier=Verical
R?#1-R?#4 R?#7-R?#10 = Res_0402: Manufacturer: Yageo; Manufacturer Part Number 1: RC0201FR-0747RL; Part Description: 47 Ohms ±1% 0.05W, 1/20W Chip Resistor 0201 (0603 Metric) Moisture Resistant Thick Film; Power Rating: 50mW; Voltage Rating: 25V; Temperature Coefficient: 200ppm/°C; Value: 47R, 1%; Supplier 1: Digi-Key; Supplier Part Number 1: YAG2694CT-ND; Stock 1: 778022; Pricing 1: 1=0,10000, 10=0,03700, 100=0,01530, 1000=0,00685, 2500=0,00595, 5000=0,00491 (USD); RoHS: Yes; Case/Package: 0201; Case Code (Imperial): 0201; Case Code (Metric): 0603; Min Operating Temperature: -55°C; Max Operating Temperature: 125°C; Packaging: Tape and Reel; Resistance: 47R; Tolerance: 1%; Resistor Type: Thick Film; Termination: SMD/SMT; Number of Terminations: 2; Max Power Dissipation: 50mW; Features: Moisture Resistant; Series: RC; Resistance Tolerance: 1%; Length: 0.6mm; Width: 0.3mm; Height: 0.23mm; Reach SVHC Compliant: Yes; RoHS Compliant: Yes; ComponentLink1URL: https://datasheet.ciiva.com/5924/1563626-5924912.pdf?src-supplier=Farnell; ComponentLink1Description: https://datasheet.ciiva.com/5924/1563626-5924912.pdf?src-supplier=Farnell; ComponentLink2URL: https://datasheet.ciiva.com/22661/1563626-22661319.pdf?src-supplier=Element14; ComponentLink2Description: https://datasheet.ciiva.com/22661/1563626-22661319.pdf?src-supplier=Element14
R?#5 R?#6 = Res_0402: Manufacturer: Yageo; Manufacturer Part Number 1: RC0201FR-0710KL; Part Description: 10 kOhms ±1% 0.05W, 1/20W Chip Resistor 0201 (0603 Metric) Moisture Resistant Thick Film; Resistance: 10kR; Power Rating: 50mW; Voltage Rating: 25V; Temperature Coefficient: 200ppm/°C; Value: 10k, 1%; ComponentLink1URL: https://datasheet.ciiva.com/5924/1563626-5924912.pdf?src-supplier=Farnell; ComponentLink1Description: https://datasheet.ciiva.com/5924/1563626-5924912.pdf?src-supplier=Farnell; ComponentLink2URL: https://datasheet.ciiva.com/22661/1563626-22661319.pdf?src-supplier=Element14; ComponentLink2Description: https://datasheet.ciiva.com/22661/1563626-22661319.pdf?src-supplier=Element14; Supplier 1: Digi-Key; Supplier Part Number 1: 311-10.0KMCT-ND; Stock 1: 17142315; Pricing 1: 1=0,10000, 10=0,03700, 100=0,01530, 1000=0,00685, 2500=0,00595, 5000=0,00491 (USD); RoHS: Yes; Case/Package: 0201; Number of Pins: 2; Case Code (Imperial): 0201; Case Code (Metric): 0603; Contact Plating: Tin,Matte; Weight: 6E-06oz; Min Operating Temperature: -55°C; Max Operating Temperature: 125°C; Tolerance: 1%; Packaging: Tape and Reel; Package Quantity: 10000; Termination: SMD/SMT; Resistor Type: Thick Film; Number of Terminations: 2; Max Power Dissipation: 50mW; Voltage Rating (DC): 25V; Features: Moisture Resistant; Series: RC; Resistance Tolerance: 1%; Construction: Rectangular; Working Voltage: 25V; Technology: THICK FILM; Length: 0.6mm; Width: 0.012inch; Height: 0.01inch; Depth: 0.3mm; Radiation Hardening: No; Reach SVHC Compliant: Yes; Military Standard: Not; Lead Free: Lead Free; RoHS Compliant: Yes; ComponentLink3URL: https://datasheet.ciiva.com/7660/1421516-7660807.pdf?src-supplier=Element14; ComponentLink3Description: https://datasheet.ciiva.com/7660/1421516-7660807.pdf?src-supplier=Element14; ComponentLink4URL: https://datasheet.ciiva.com/46391/1421516-46391339.pdf?src-supplier=Element14; ComponentLink4Description: https://datasheet.ciiva.com/46391/1421516-46391339.pdf?src-supplier=Element14; ComponentLink5URL: https://datasheet.ciiva.com/2467/pyu-r-int-thick-7-2467110.pdf?src-supplier=Digi-Key; ComponentLink5Description: https://datasheet.ciiva.com/2467/pyu-r-int-thick-7-2467110.pdf?src-supplier=Digi-Key; ComponentLink6URL: https://datasheet.ciiva.com/2467/pyu-r-int-thick-7-2467111.pdf?src-supplier=Digi-Key; ComponentLink6Description: https://datasheet.ciiva.com/2467/pyu-r-int-thick-7-2467111.pdf?src-supplier=Digi-Key; ComponentLink7URL: https://datasheet.ciiva.com/2467/pyu-r-int-thick-7-2467109.pdf?src-supplier=Digi-Key; ComponentLink7Description: https://datasheet.ciiva.com/2467/pyu-r-int-thick-7-2467109.pdf?src-supplier=Digi-Key